# EAGLE design dip8_a2 (EAGLE 5.11)
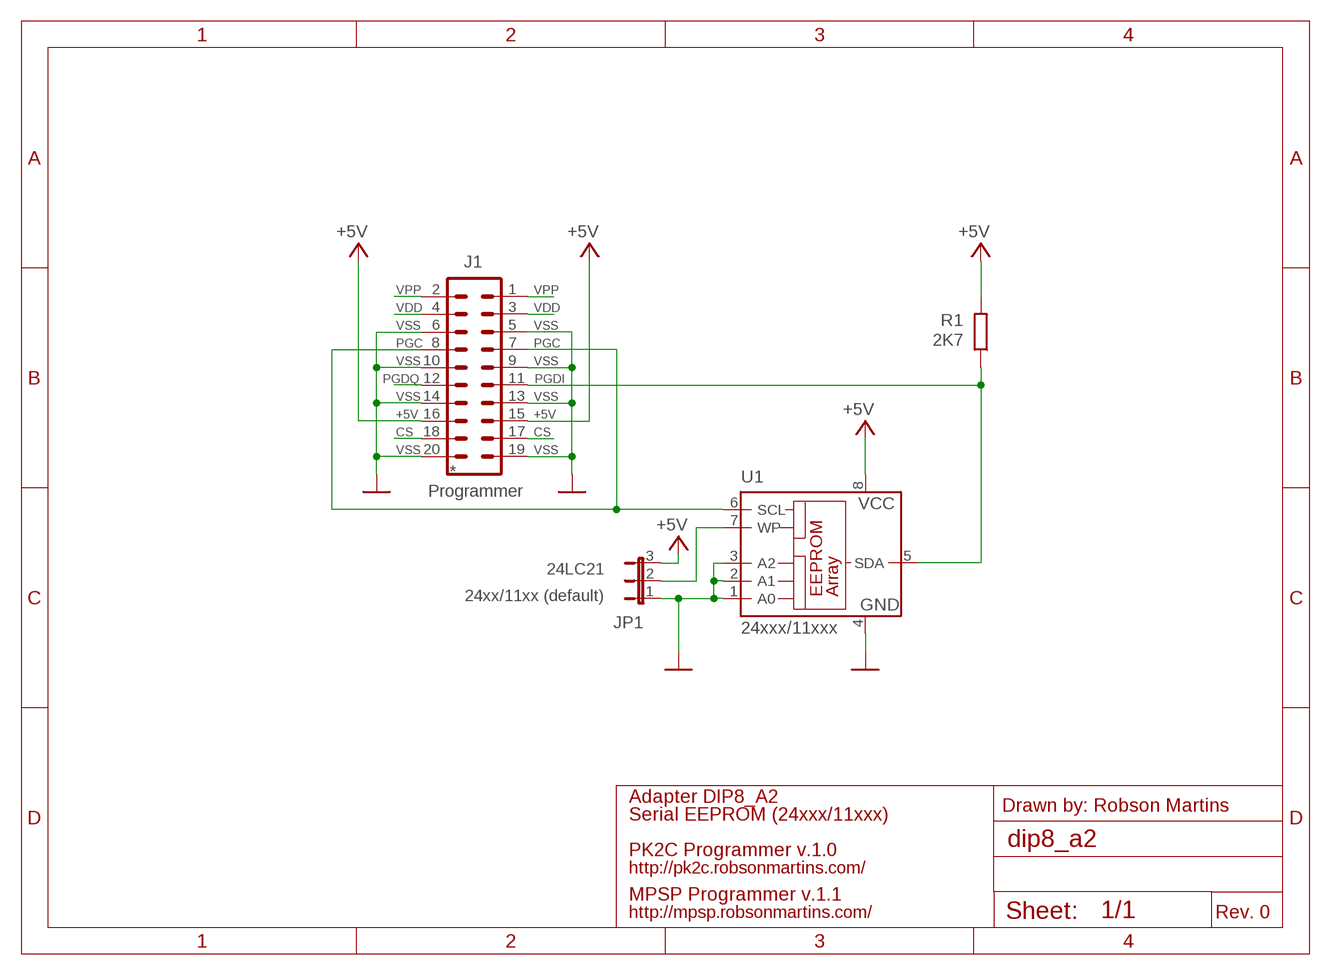
[diagram p0: schematic, sheet 1]

## Parts
J1  Programmer  MA10-2  [MA10-2]
JP1  JP2E  [JP2]
R1  2K7  R-EU_0204/7  [0204/7]
U1  24xxx/11xxx  24C01AP  [DIL8]

## Nets
+5V: J1.15 J1.16 JP1.3 R1.2 U1.8(VCC)
CS: J1.17 J1.18
GND: J1.5 J1.6 J1.9 J1.10 J1.13 J1.14 J1.19 J1.20 JP1.1 U1.1(A0) U1.2(A1) U1.3(A2) U1.4(GND)
PGC: J1.7 J1.8 U1.6(SCL)
PGDI: J1.11 R1.1 U1.5(SDA)
PGDQ: J1.12
VDD: J1.3 J1.4
VPP: J1.1 J1.2
WP_CHIP: JP1.2 U1.7(WP)

## Notes on the sheet
- VPP | VPP
- VDD | VDD
- VSS | VSS
- PGC | PGC
- VSS | VSS
- PGDQ | PGDI
- VSS | VSS
- +5V | +5V
- CS | CS
- VSS | VSS
- *
- 24LC21
- 24xx/11xx (default)
- Adapter DIP8_A2
- Drawn by: Robson Martins
- Serial EEPROM (24xxx/11xxx)
- PK2C Programmer v.1.0
- http://pk2c.robsonmartins.com/
- MPSP Programmer v.1.1
- http://mpsp.robsonmartins.com/ | Rev. 0

## Library data of the parts
J1 = con-lstb:MA10-2: PIN HEADER; OC_FARNELL: unknown; OC_NEWARK: unknown
JP1 = jumper:JP2E: JUMPER
R1 = resistor:R-EU_: RESISTOR, European symbol
U1 = microchip:24C*: Serial EEPROM 1 K/2 K/4 K; MF: Arrow Electronics; MPN: M24C01-WBN6P; OC_FARNELL: 9882782; OC_NEWARK: 93K7306

## Board
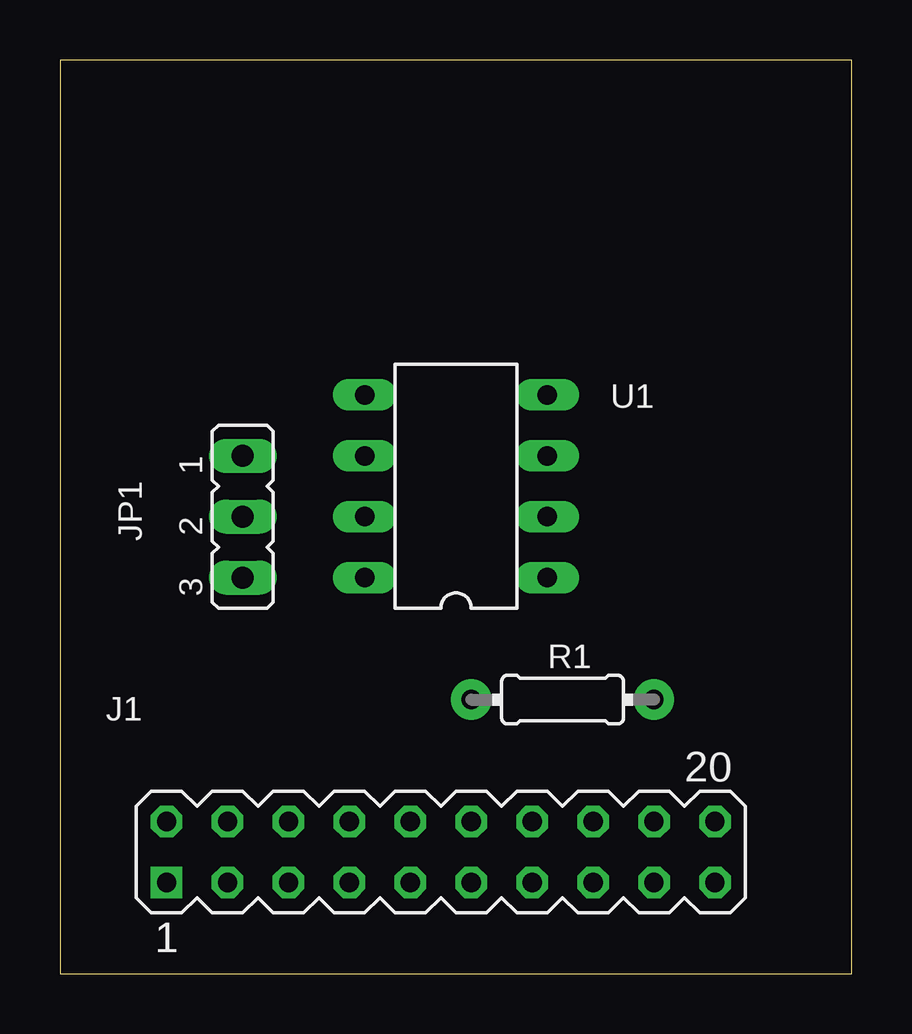
[diagram p1: board, top side]
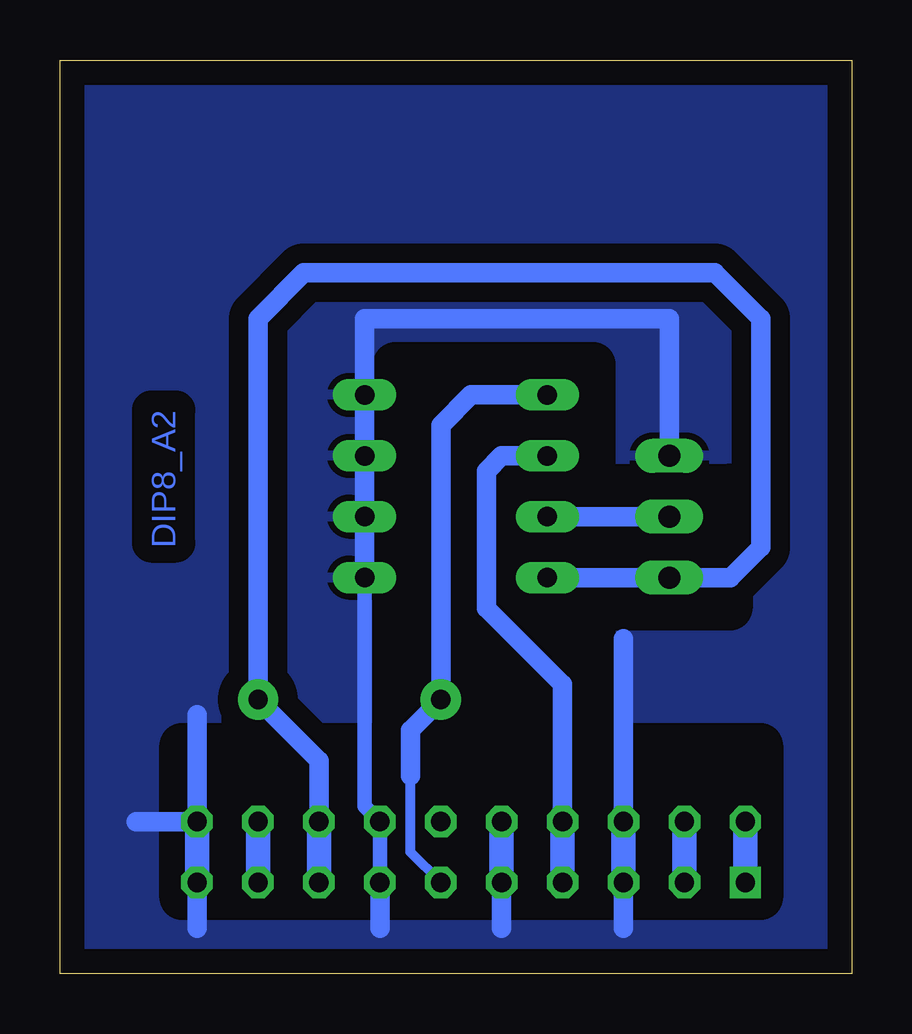
[diagram p2: board, bottom side, seen from below]

Size 33.02 x 38.08 mm. Coordinates in mm from the lower left corner, seen from the top.
Outline: 33.02,0 33.02,38.08 0,38.08 0,0 33.02,0
Copper layers (1*16): Top 0.035mm / dielectric 1.5mm / Bottom 0.035mm
Design rules "default": minimum track width 10mil, minimum drill 24mil, track to track 8mil, track to pad 8mil, pad to pad 8mil, via to via 8mil, smd to smd 8mil, copper to edge 40mil, drill to drill 8mil, minimum pad ring 10mil, minimum via ring 8mil, stop-mask expansion 4mil, vias tented up to drill 0mil, thermal gap 10mil
bRestrict: area 3.8,3.2 to 27.9,9.5; area 5.1,9.5 to 19.1,25.4

### Footprints (pad centres in the part's own frame; a part is rotated, then mirrored left to right if it is on the bottom)
MA10-2 = drill 0.8 pad 1.27 square: 1 -11.43,-1.27 | drill 0.8 pad 1.27 octagon: 2 -11.43,1.27; 3 -8.89,-1.27; 4 -8.89,1.27; 5 -6.35,-1.27; 6 -6.35,1.27; 7 -3.81,-1.27; 8 -3.81,1.27; 9 -1.27,-1.27; 10 -1.27,1.27; 11 1.27,-1.27; 12 1.27,1.27; 13 3.81,-1.27; 14 3.81,1.27; 15 6.35,-1.27; 16 6.35,1.27; 17 8.89,-1.27; 18 8.89,1.27; 19 11.43,-1.27; 20 11.43,1.27
JP2 = drill 0.914 long: 1 -2.54,0; 2 0,0; 3 2.54,0
0204/7 = drill 0.813 pad 1.676 round: 1 -3.81,0 | drill 0.8 pad 1.676 round: 2 3.81,0
DIL8 = drill 0.813 long: 1 -3.81,-3.81; 2 -1.27,-3.81; 3 1.27,-3.81; 4 3.81,-3.81; 5 3.81,3.81; 6 1.27,3.81; 7 -1.27,3.81; 8 -3.81,3.81

### Placement (x,y rotation side)
J1  15.88,5.08 0 top
JP1  7.62,19.05 270 top
R1  20.96,11.43 0 top
U1  16.51,20.32 90 top

### Tracks (layer width: path | path; a pad name or v marks a point on that pad's centre or on a via)
+5V
  Bottom 0.813: J1.16 22.23,8.89 R1.2 24.77,26.04 24.77,27.3 22.86,29.21 5.72,29.21 3.81,27.3 3.81,26.67 3.81,17.78 5.08,16.51 U1.8 JP1.3
  Bottom 1.016: J1.16 J1.15
CS
  Bottom 1.016: J1.17 J1.18
GND
  Bottom 0.61: U1.1 20.32,8.89 20.32,7.62 20.32,6.99 J1.14 J1.13
  Bottom 0.813: 9.53,1.91 J1.6 9.53,8.89 9.53,13.97 | 14.61,1.91 J1.9 | U1.1 U1.2 U1.3 U1.4 20.32,27.3 7.62,27.3 JP1.1 | 27.31,1.91 J1.19 | 29.85,6.35 J1.20 27.31,10.79 | 19.69,1.91 J1.13
  Bottom 1.016: J1.6 J1.5 | J1.9 J1.10 | J1.19 J1.20
  pour Bottom (isolate 0.813): 33.02,0 0,0 0,38.1 33.02,38.1
PGC
  Bottom 0.813: U1.6 14.61,21.59 15.24,20.95 15.24,15.24 12.07,12.06 J1.8
  Bottom 1.016: J1.7 J1.8
PGDI
  Bottom 0.406: 18.42,8.89 18.42,8.26 18.42,5.08 J1.11
  Bottom 0.813: U1.5 15.88,24.13 17.15,22.86 R1.1 18.42,10.16 18.42,8.26
VDD
  Bottom 1.016: J1.3 J1.4
VPP
  Bottom 1.016: J1.1 J1.2
WP_CHIP
  Bottom 0.813: JP1.2 U1.7

### Text on the board
Bottom: DIP8_A2
tDocu: Serial EEPROM | 24xxx/11xxx | DIP8_A2 | Adapter | 24xx/11xx | 24LC21 | VSS | VPP | VDD | VSS | PGC | VSS | PGD | VSS | +5V | CS